# Altium schematic sheet 004-H-01 SD data logger cover.SchDoc: 004-H-01 SD data logger
size A3; Organization: Sunflare Solar Team; Address1: Drachten; Address2: The Netherlands; Revision: V1.00; SheetNumber: 1; SheetTotal: 1
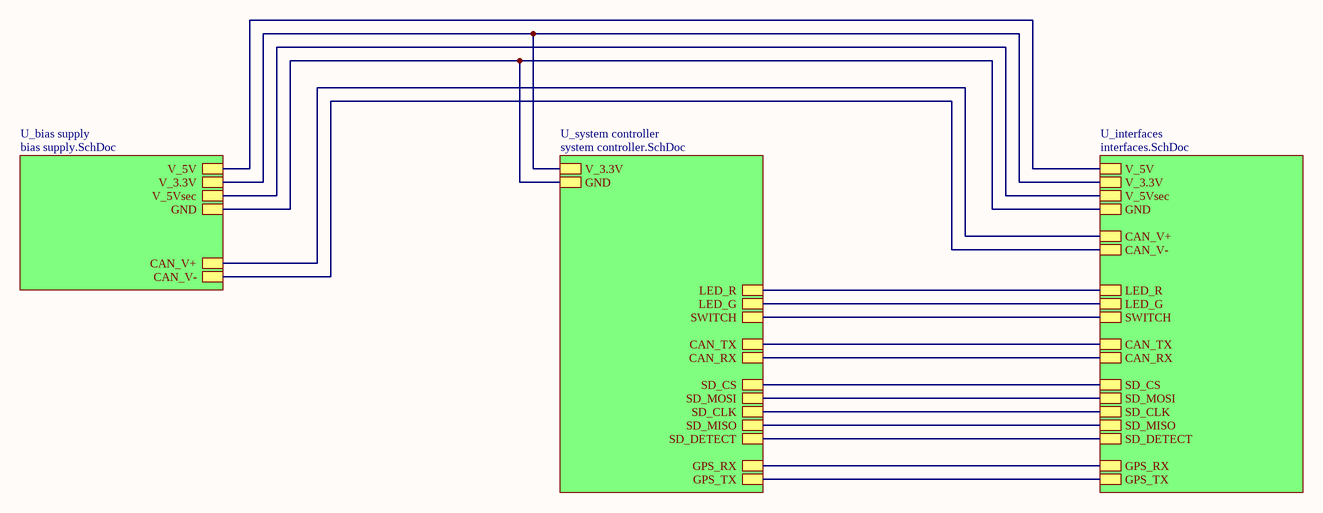
[diagram p0: 004-H-01 SD data logger cover.SchDoc]

## Sub-sheets
U_bias supply = bias supply.SchDoc: V_5V, V_5Vsec, V_3.3V, GND, CAN_V-, CAN_V+
U_interfaces = interfaces.SchDoc: CAN_V-, CAN_V+, CAN_TX, CAN_RX, LED_R, LED_G, V_5V, V_3.3V, V_5Vsec, GND, SWITCH, SD_CS, SD_MOSI, SD_CLK, SD_MISO, SD_DETECT, GPS_RX, GPS_TX
U_system controller = system controller.SchDoc: V_3.3V, GND, CAN_TX, CAN_RX, LED_R, LED_G, SWITCH, SD_CS, SD_MOSI, SD_CLK, SD_MISO, SD_DETECT, GPS_RX, GPS_TX

## Nets
(unnamed): sheet U_bias supply/V_5V, sheet U_interfaces/V_5V
(unnamed): sheet U_bias supply/V_5Vsec, sheet U_interfaces/V_5Vsec
(unnamed): sheet U_bias supply/V_3.3V, sheet U_interfaces/V_3.3V, sheet U_system controller/V_3.3V
(unnamed): sheet U_bias supply/GND, sheet U_interfaces/GND, sheet U_system controller/GND
(unnamed): sheet U_bias supply/CAN_V-, sheet U_interfaces/CAN_V-
(unnamed): sheet U_bias supply/CAN_V+, sheet U_interfaces/CAN_V+
(unnamed): sheet U_interfaces/CAN_TX, sheet U_system controller/CAN_TX
(unnamed): sheet U_interfaces/CAN_RX, sheet U_system controller/CAN_RX
(unnamed): sheet U_interfaces/LED_R, sheet U_system controller/LED_R
(unnamed): sheet U_interfaces/LED_G, sheet U_system controller/LED_G
(unnamed): sheet U_interfaces/SWITCH, sheet U_system controller/SWITCH
(unnamed): sheet U_interfaces/SD_CS, sheet U_system controller/SD_CS
(unnamed): sheet U_interfaces/SD_MOSI, sheet U_system controller/SD_MOSI
(unnamed): sheet U_interfaces/SD_CLK, sheet U_system controller/SD_CLK
(unnamed): sheet U_interfaces/SD_MISO, sheet U_system controller/SD_MISO
(unnamed): sheet U_interfaces/SD_DETECT, sheet U_system controller/SD_DETECT
(unnamed): sheet U_interfaces/GPS_RX, sheet U_system controller/GPS_RX
(unnamed): sheet U_interfaces/GPS_TX, sheet U_system controller/GPS_TX

## Notes on the sheet
- Title
- Size:
- Date:
- A3
- Version:
- Sheet
- of